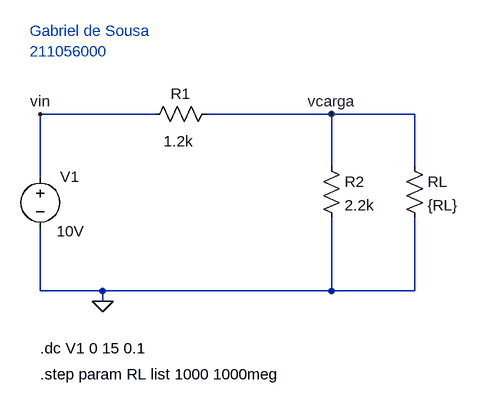
[diagram p0: schematic item_2.asc]
item_2.asc, the LTspice schematic file:
Version 4.1
SHEET 1 66232 692
WIRE -64 32 -240 32
WIRE 208 32 16 32
WIRE 336 32 208 32
WIRE 208 112 208 32
WIRE 336 112 336 32
WIRE -240 128 -240 32
WIRE -240 304 -240 208
WIRE -144 304 -240 304
WIRE 208 304 208 192
WIRE 208 304 -144 304
WIRE 336 304 336 192
WIRE 336 304 208 304
WIRE -144 320 -144 304
FLAG -144 320 0
FLAG -240 32 vin
FLAG 208 32 vcarga
SYMBOL voltage -240 112 R0
WINDOW 0 45 16 Center 2
WINDOW 3 68 100 Right 2
WINDOW 123 0 0 Left 0
WINDOW 39 0 0 Left 0
SYMATTR InstName V1
SYMATTR Value 10V
SYMBOL res 192 96 R0
SYMATTR InstName R2
SYMATTR Value 2.2k
SYMBOL res 320 96 R0
SYMATTR InstName RL
SYMATTR Value {RL}
SYMBOL res 32 16 R90
WINDOW 0 0 56 VBottom 2
WINDOW 3 58 59 VCenter 2
SYMATTR InstName R1
SYMATTR Value 1.2k
TEXT -240 392 Left 2 !.dc V1 0 15 0.1
TEXT -256 -96 Left 2 ;Gabriel de Sousa\n211056000
TEXT -240 432 Left 2 !.step param RL list 1000 1000meg

The netlist it stands for:
* item_2.asc
V1 vin 0 10V
R2 vcarga 0 2.2k
RL vcarga 0 {RL}
R1 vcarga vin 1.2k
.dc V1 0 15 0.1
* Gabriel de Sousa
* 211056000
.step param RL list 1000 1000meg
.backanno
.end